# EAGLE design ManualOxy (EAGLE 6.5.0)
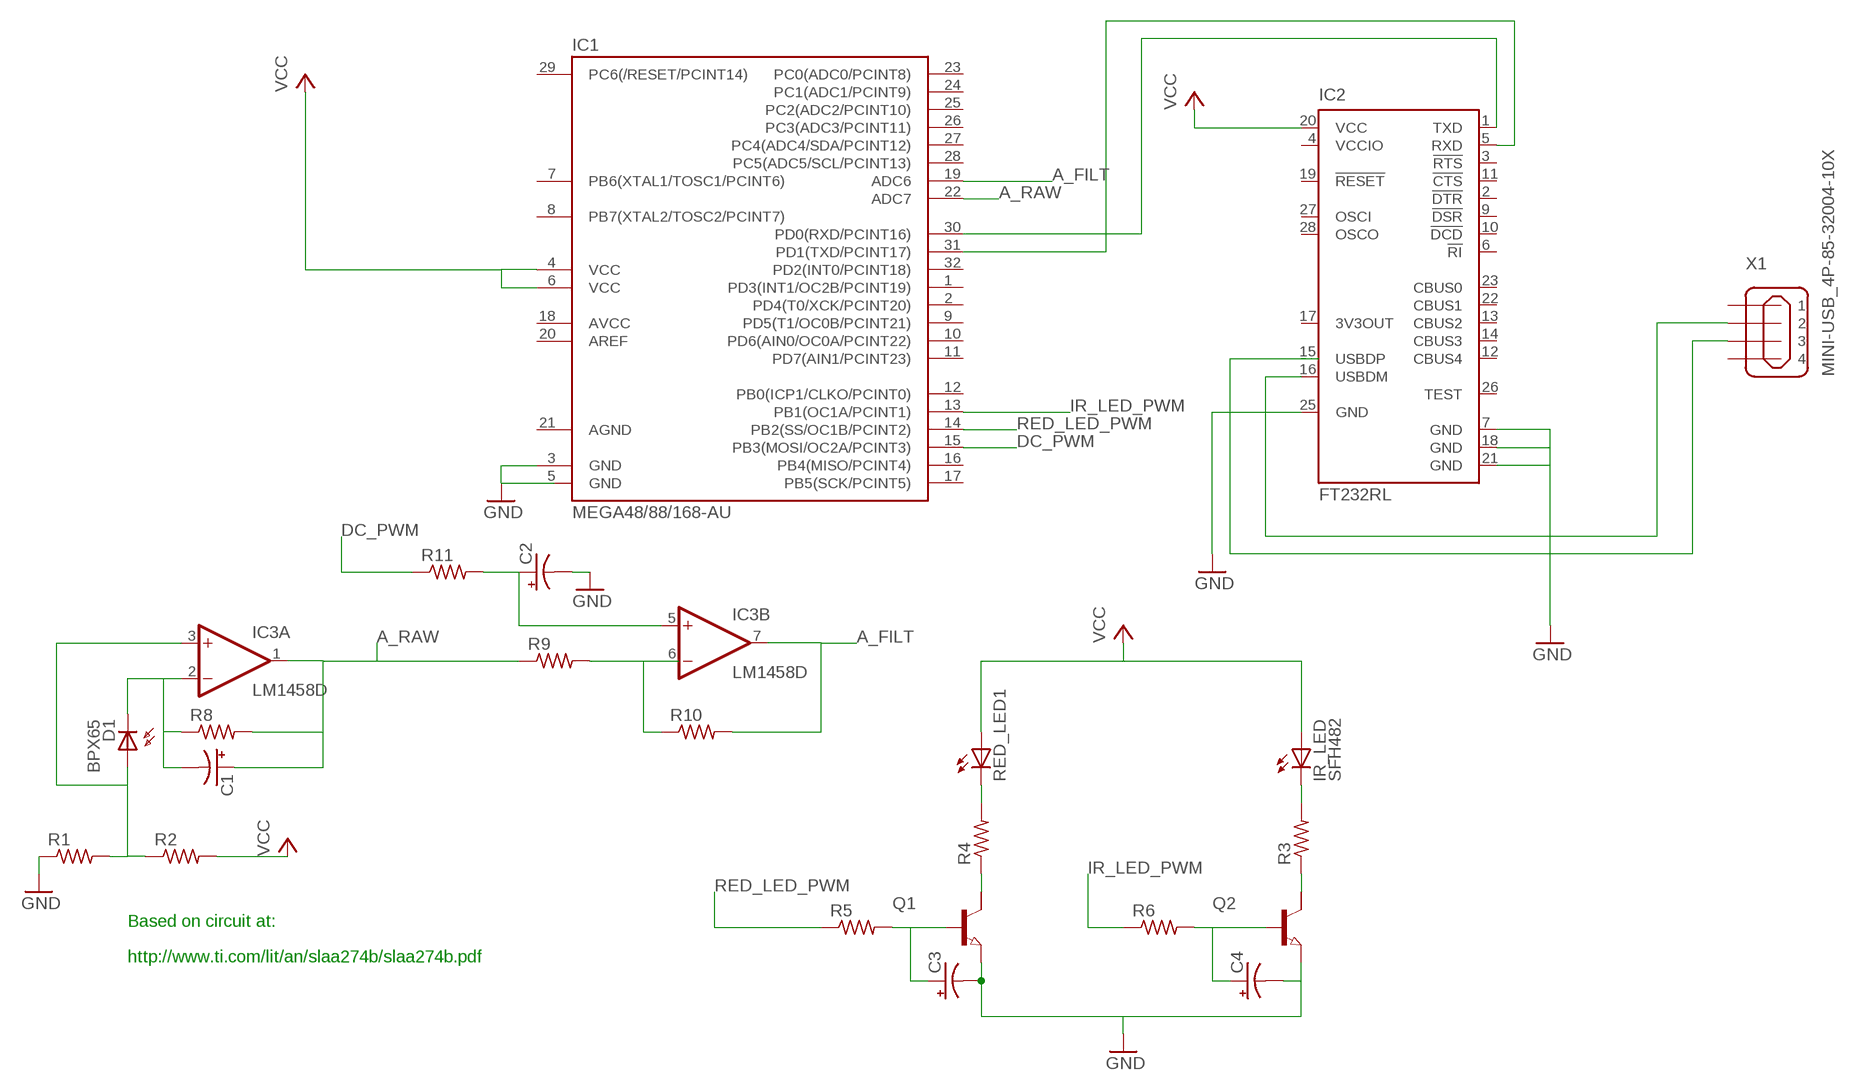
[diagram p0: schematic, sheet 1]

## Parts
C1  CPOL-US153CLV-0810  [153CLV-0810]
C2  CPOL-US153CLV-0810  [153CLV-0810]
C3  CPOL-US153CLV-0810  [153CLV-0810]
C4  CPOL-US153CLV-0810  [153CLV-0810]
D1  BPX65  [BPX65]
IC1  MEGA48/88/168-AU  [TQFP32-08]
IC2  FT232RL  [SSOP28]
IC3  LM1458D  [SO08]
IR_LED  SFH482  [SFH482]
Q1  NPN-TRANSISTIOR-2COLSOT143  [SOT143]
Q2  NPN-TRANSISTIOR-2COLSOT143  [SOT143]
R1  R-US_M2012  [M2012]
R2  R-US_M2012  [M2012]
R3  R-US_M2012  [M2012]
R4  R-US_M2012  [M2012]
R5  R-US_M2012  [M2012]
R6  R-US_M2012  [M2012]
R8  R-US_M2012  [M2012]
R9  R-US_M2012  [M2012]
R10  R-US_M2012  [M2012]
R11  R-US_M2012  [M2012]
RED_LED1  LED10MM  [LED10MM]
X1  MINI-USB_4P-85-32004-10X  [85-32004-10X]

## Nets
A_FILT: IC3.7(B:OUT) R10.2
A_RAW: C1.+ IC3.1(A:OUT) R8.2 R9.1
DC_PWM: IC1.15(PB3(MOSI/OC2A/PCINT3))
GND: C2.- C3.- C4.- IC1.3(GND) IC2.7(GND) IC2.18(GND) IC2.21(GND) IC2.25(GND) Q1.3(E) Q2.3(E) R1.1
IR_LED_PWM: IC1.13(PB1(OC1A/PCINT1))
N$1: IC1.30(PD0(RXD/PCINT16)) IC2.1(TXD)
N$2: IC1.31(PD1(TXD/PCINT17)) IC2.5(RXD)
N$3: IC2.16(USBDM) X1.2
N$4: X1.3
N$5: Q1.2(C) R4.1
N$6: R4.2 RED_LED1.K(C)
N$7: IR_LED.K(C) R3.2
N$8: Q2.2(C) R3.1
N$9: D1.A IC3.3(A:+IN) R1.2 R2.1
N$10: C1.- D1.K(C) IC3.2(A:-IN) R8.1
N$11: IC1.22(ADC7)
N$12: R9.2 R10.1
N$13: IC1.19(ADC6)
N$14: C2.+ IC3.5(B:+IN) R11.2
N$15: R11.1
N$16: C3.+ Q1.1(B) R5.2
N$17: R6.1
N$18: C4.+ Q2.1(B) R6.2
RED_LED_PWM: IC1.14(PB2(SS/OC1B/PCINT2))
VCC: IC1.4(VCC) IC1.6(VCC) IC2.20(VCC) IR_LED.A R2.2 RED_LED1.A
Unconnected: IC1.1(PD3(INT1/OC2B/PCINT19)) IC1.2(PD4(T0/XCK/PCINT20)) IC1.7(PB6(XTAL1/TOSC1/PCINT6)) IC1.8(PB7(XTAL2/TOSC2/PCINT7)) IC1.9(PD5(T1/OC0B/PCINT21)) IC1.10(PD6(AIN0/OC0A/PCINT22)) IC1.11(PD7(AIN1/PCINT23)) IC1.12(PB0(ICP1/CLKO/PCINT0)) IC1.16(PB4(MISO/PCINT4)) IC1.17(PB5(SCK/PCINT5)) IC1.18(AVCC) IC1.20(AREF) IC1.23(PC0(ADC0/PCINT8)) IC1.24(PC1(ADC1/PCINT9)) IC1.25(PC2(ADC2/PCINT10)) IC1.26(PC3(ADC3/PCINT11)) IC1.27(PC4(ADC4/SDA/PCINT12)) IC1.28(PC5(ADC5/SCL/PCINT13)) IC1.29(PC6(/RESET/PCINT14)) IC1.32(PD2(INT0/PCINT18)) IC2.2(!DTR) IC2.3(!RTS) IC2.6(!RI) IC2.9(!DSR) IC2.10(!DCD) IC2.11(!CTS) IC2.12(CBUS4) IC2.13(CBUS2) IC2.14(CBUS3) IC2.15(USBDP) IC2.17(3V3OUT) IC2.19(!RESET) IC2.22(CBUS1) IC2.23(CBUS0) IC2.26(TEST) IC2.27(OSCI) IC2.28(OSCO) IC3.6(B:-IN) Q1.4(C/) Q2.4(C/) R5.1 X1.1 X1.4

## Notes on the sheet
- Based on circuit at:
- http://www.ti.com/lit/an/slaa274b/slaa274b.pdf

## Power pins joined to a net without a drawn wire
AGND: IC1.21(AGND)
GND: IC1.5(GND)
V+: IC3.8(P:V+)
V-: IC3.4(P:V-)
VCCIO: IC2.4(VCCIO)

## Library data of the parts
C1-C4 = resistor:CPOL-US: POLARIZED CAPACITOR, American symbol
D1 = opto-trans-siemens:BPX65: PHOTO DIODE; MPN: BPX65.; OC_FARNELL: 327451; OC_NEWARK: 06WX2764
IC1 = avr-4:MEGA48/88/168
IC2 = ftdichip:FT232R: Source: http://www.ftdichip.com/Documents/DataSheets/DS_FT232R_v104.pdf; MPN: FT232RL; OC_FARNELL: 1146032; OC_NEWARK: 91K9918
IC3 = linear:*1458: OP AMP
IR_LED = led:SFH482: IR LED infrared emitting diode, Infineon
Q1 Q2 = semicon-smd-ipc:NPN-TRANSISTIOR-2COL: NPN TRANSISTOR 2 colletor pins
R1-R6 R8-R11 = rcl:R-US_: RESISTOR, American symbol
RED_LED1 = led:LED: LED OSRAM: - CHIPLED LG R971, LG N971, LY N971, LG Q971, LY Q971, LO R971, LY R971 LH N974, LH R974 LS Q976, LO Q976, LY Q976 LO Q996 - Hyper CHIPLED LW Q18S LB Q993, LB Q99A, LB R99A - SideLED LS A670, LO A670, LY A670, LG A670, LP A670 LB A673, LV A673, LT A673, LW A673 LH A674 LY A675 LS A676, LA A676, LO A676, LY A676, LW A676 LS A679, LY A679, LG A679 - Hyper Micro SIDELED® LS Y876, LA Y876, LO Y876, LY Y876 LT Y87S - SmartLED LW L88C, LW L88S LB L89C, LB L89S, LG L890 LS L89K, LO L89K, LY L89K LS L896, LA L896, LO L896, LY L896 - TOPLED LS T670, LO T670, LY T670, LG T670, LP T670 LSG T670, LSP T670, LSY T670, LOP T670, LYG T670 LG T671, LOG T671, LSG T671 LB T673, LV T673, LT T673, LW T673 LH T674 LS T676, LA T676, LO T676, LY T676, LB T676, LH T676, LSB T676, LW T676 LB T67C, LV T67C, LT T67C, LS T67K, LO T67K, LY T67K, LW E67C LS E67B, LA E67B, LO E67B, LY E67B, LB E67C, LV E67C, LT E67C LW T67C LS T679, LY T679, LG T679 LS T770, LO T770, LY T770, LG T770, LP T770 LB T773, LV T773, LT T773, LW T773 LH T774 LS E675, LA E675, LY E675, LS T675 LS T776, LA T776, LO T776, LY T776, LB T776 LHGB T686 LT T68C, LB T68C - Hyper Mini TOPLED® LB M676 - Mini TOPLED Santana® LG M470 LS M47K, LO M47K, LY M47K Source: http://www.osram.convergy.de LUXEON: - LUMILED® LXK2-PW12-R00, LXK2-PW12-S00, LXK2-PW14-U00, LXK2-PW14-V00 LXK2-PM12-R00, LXK2-PM12-S00, LXK2-PM14-U00 LXK2-PE12-Q00, LXK2-PE12-R00, LXK2-PE12-S00, LXK2-PE14-T00, LXK2-PE14-U00 LXK2-PB12-K00, LXK2-PB12-L00, LXK2-PB12-M00, LXK2-PB14-N00, LXK2-PB14-P00, LXK2-PB14-Q00 LXK2-PR12-L00, LXK2-PR12-M00, LXK2-PR14-Q00, LXK2-PR14-R00 LXK2-PD12-Q00, LXK2-PD12-R00, LXK2-PD12-S00 LXK2-PH12-R00, LXK2-PH12-S00 LXK2-PL12-P00, LXK2-PL12-Q00, LXK2-PL12-R00 Source: www.luxeon.com KINGBRIGHT: KA-3528ASYC Source: www.kingbright.com
X1 = con-cypressindustries:MINI-USB_4P-: MINI USB 4 Pol. Source: www.cypressindustries.com; OC_FARNELL: unknown; OC_NEWARK: unknown

## Board
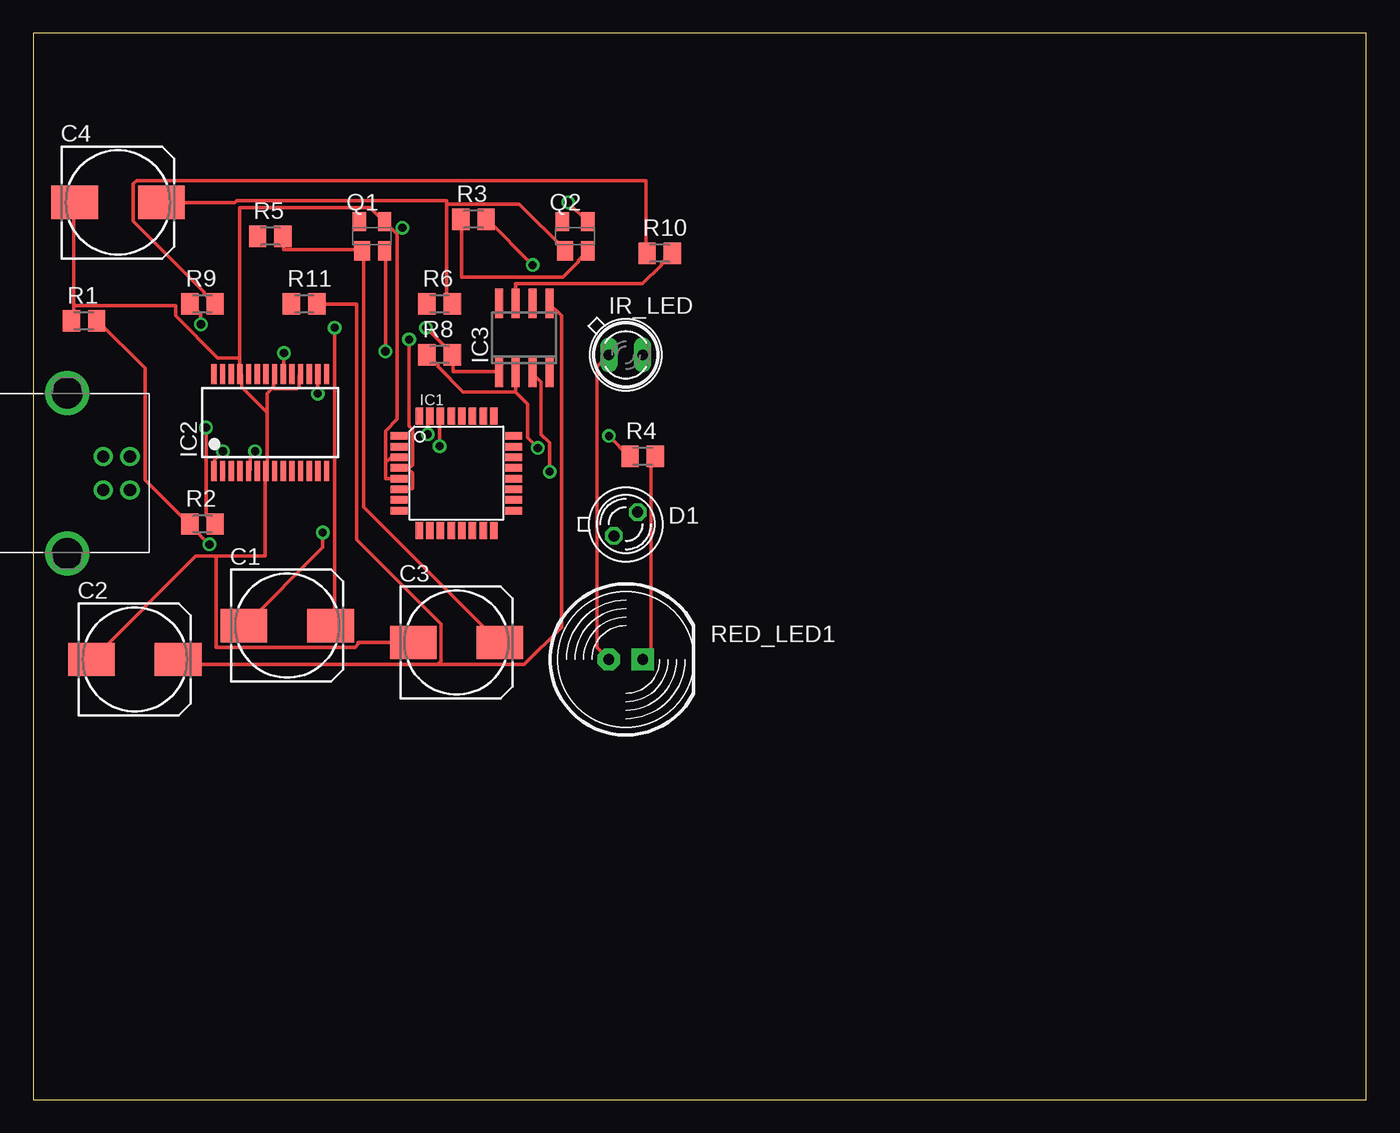
[diagram p1: board, top side]
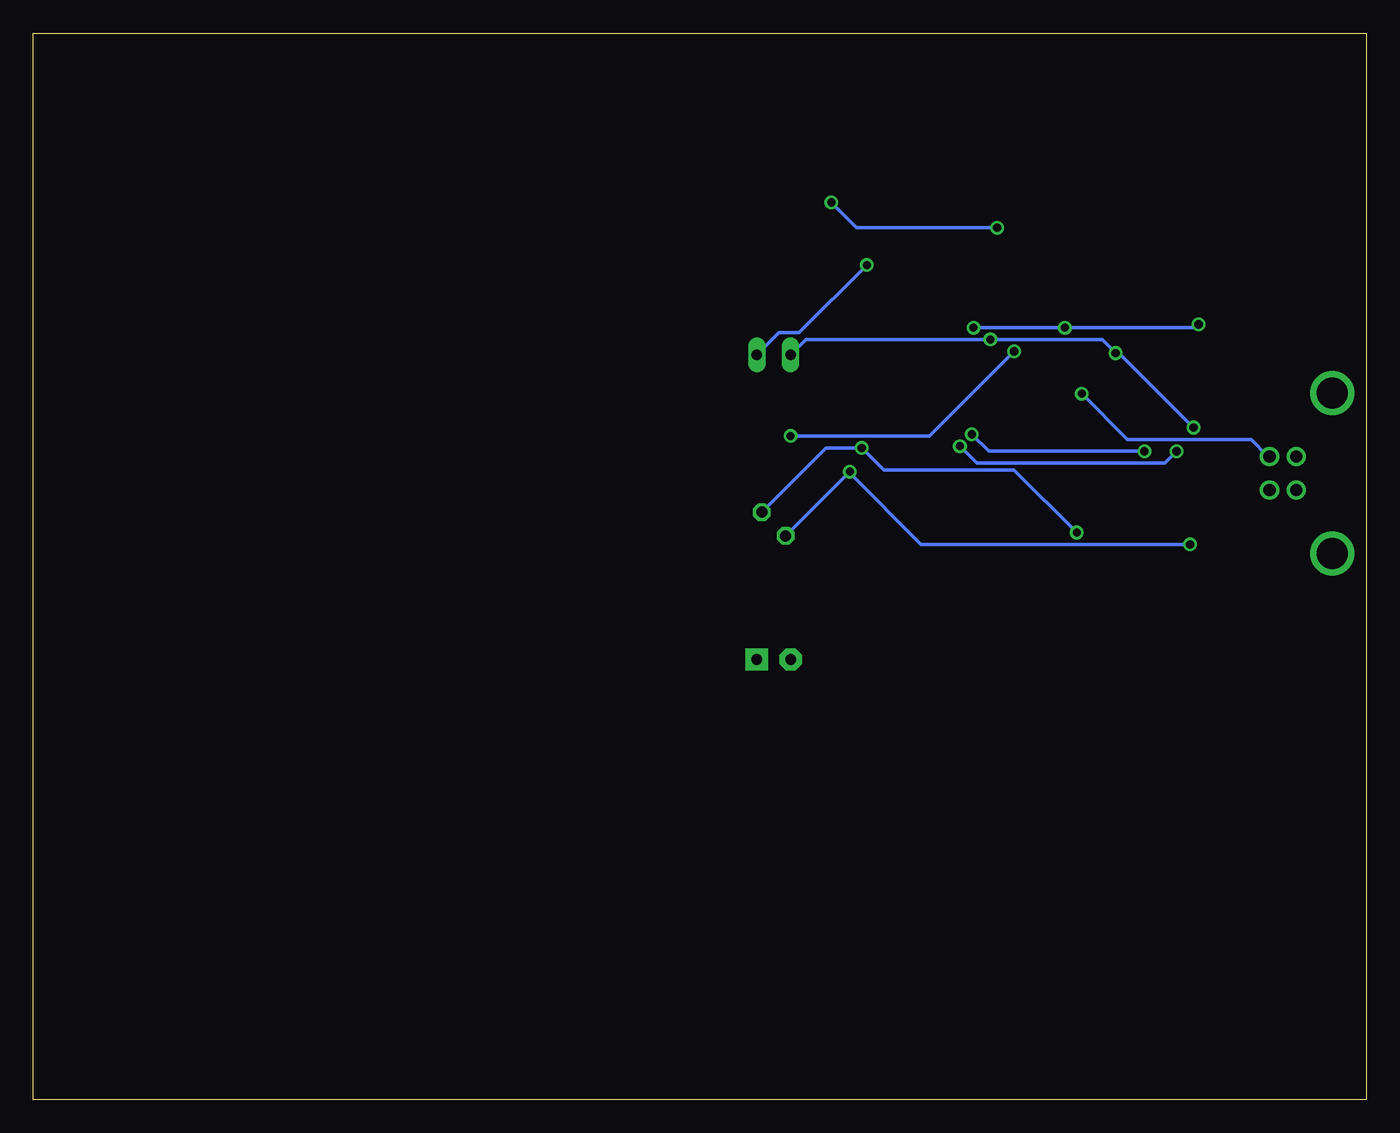
[diagram p2: board, bottom side, seen from below]

Size 100 x 80 mm. Coordinates in mm from the lower left corner, seen from the top.
Outline: 0,0 100,0 100,80 0,80 0,0
Copper layers (1*16): Top 0.035mm / dielectric 1.5mm / Bottom 0.035mm
Design rules "default": minimum track width 10mil, minimum drill 24mil, track to track 8mil, track to pad 8mil, pad to pad 8mil, via to via 8mil, smd to smd 8mil, copper to edge 40mil, drill to drill 8mil, minimum pad ring 10mil, minimum via ring 8mil, stop-mask expansion 4mil, vias tented up to drill 0mil, thermal gap 10mil

### Footprints (pad centres in the part's own frame; a part is rotated, then mirrored left to right if it is on the bottom)
153CLV-0810 = smd 3.5 x 2.5: + 3.25,0; - -3.25,0
BPX65 = drill 0.813 octagon: A -0.889,-0.889; K 0.889,0.889
TQFP32-08 = smd 1.27 x 0.559: 1 -4.293,2.8; 2 -4.293,2; 3 -4.293,1.2; 4 -4.293,0.4; 5 -4.293,-0.4; 6 -4.293,-1.2; 7 -4.293,-2; 8 -4.293,-2.8; 17 4.293,-2.8; 18 4.293,-2; 19 4.293,-1.2; 20 4.293,-0.4; 21 4.293,0.4; 22 4.293,1.2; 23 4.293,2; 24 4.293,2.8 | smd 0.559 x 1.27: 9 -2.8,-4.293; 10 -2,-4.293; 11 -1.2,-4.293; 12 -0.4,-4.293; 13 0.4,-4.293; 14 1.2,-4.293; 15 2,-4.293; 16 2.8,-4.293; 25 2.8,4.293; 26 2,4.293; 27 1.2,4.293; 28 0.4,4.293; 29 -0.4,4.293; 30 -1.2,4.293; 31 -2,4.293; 32 -2.8,4.293
SSOP28 = smd 0.4 x 1.5: 1 -4.225,-3.625; 2 -3.575,-3.625; 3 -2.925,-3.625; 4 -2.275,-3.625; 5 -1.625,-3.625; 6 -0.975,-3.625; 7 -0.325,-3.625; 8 0.325,-3.625; 9 0.975,-3.625; 10 1.625,-3.625; 11 2.275,-3.625; 12 2.925,-3.625; 13 3.575,-3.625; 14 4.225,-3.625; 15 4.225,3.625; 16 3.575,3.625; 17 2.925,3.625; 18 2.275,3.625; 19 1.625,3.625; 20 0.975,3.625; 21 0.325,3.625; 22 -0.325,3.625; 23 -0.975,3.625; 24 -1.625,3.625; 25 -2.275,3.625; 26 -2.925,3.625; 27 -3.575,3.625; 28 -4.225,3.625
SO08 = smd 0.6 x 2.2: 1 -1.905,-2.6; 2 -0.635,-2.6; 3 0.635,-2.6; 4 1.905,-2.6; 5 1.905,2.6; 6 0.635,2.6; 7 -0.635,2.6; 8 -1.905,2.6
SFH482 = drill 0.813 long: A -1.27,0; K 1.27,0
SOT143 = smd 1.2 x 1.44: 1 -0.75,-1.1 | smd 1 x 1.44: 2 0.95,-1.1; 3 0.95,1.1; 4 -0.95,1.1
M2012 = smd 1.3 x 1.6: 1 -0.95,0; 2 0.95,0
LED10MM = drill 0.813 pad 1.676 octagon: A -1.27,0 | drill 0.813 pad 1.676 square: K 1.27,0
85-32004-10X = drill 0.92 pad 1.27: 1 4.71,-1.25; 2 4.71,1.25; 3 2.71,1.25; 4 2.71,-1.25 | drill 2.3 pad 3: M1 0,6.02; M2 0,-6.02

### Placement (x,y rotation side)
C1  19.05,35.56 0 top
C2  7.62,33.02 0 top
C3  31.75,34.29 0 top
C4  6.35,67.31 0 top
D1  44.45,43.18 0 top
IC1  31.75,46.99 0 top
IC2  17.78,50.8 0 top
IC3  36.83,57.15 0 top
IR_LED  44.45,55.88 0 top
Q1  25.4,64.77 0 top
Q2  40.64,64.77 0 top
R1  3.81,58.42 0 top
R2  12.7,43.18 0 top
R3  33.02,66.04 0 top
R4  45.72,48.26 0 top
R5  17.78,64.77 0 top
R6  30.48,59.69 0 top
R8  30.48,55.88 0 top
R9  12.7,59.69 0 top
R10  46.99,63.5 0 top
R11  20.32,59.69 0 top
RED_LED1  44.45,33.02 0 top
X1  2.54,46.99 0 top

### Tracks (layer width: path | path; a pad name or v marks a point on that pad's centre or on a via)
A_FILT
  Top 0.254: IC3.7 36.2,61.21 45.72,61.21 47.12,62.61 47.12,62.74 47.88,63.5 R10.2
A_RAW  (via drill 0.61)
  Top 0.254: v12.57,58.17 12.57,58.93 11.81,59.69 R9.1 | v29.46,57.91 31.37,56.01 31.37,55.88 R8.2 31.5,55.88 31.5,54.61 34.92,54.61 IC3.1 | v22.61,57.91 22.61,35.81 22.35,35.56 C1.+
  Bottom 0.254: v12.57,58.17 12.83,57.91 v22.61,57.91 v29.46,57.91
GND  (via drill 0.61)
  Top 0.254: 26.48,47.82 26.8,48.13 27.43,48.13 IC1.3 | 26.48,47.82 26.42,47.75 26.42,46.61 27.43,46.61 IC1.5 | 27.24,64.96 27.3,64.9 27.3,51.05 26.42,50.16 26.42,47.88 26.48,47.82 | 27.24,64.96 26.42,65.79 Q1.3 26.29,65.91 25.27,66.93 15.49,66.93 15.49,55.63 | v40.13,67.31 41.53,65.91 Q2.3 | 27.24,64.96 v27.69,65.41 | 3.05,59.56 3.05,67.31 C4.- | 3.05,59.56 3.05,58.55 2.92,58.42 R1.1 | 17.53,51.56 17.53,52.96 17.97,53.4 | 17.53,51.56 17.53,47.24 IC2.7 17.4,47.12 17.4,40.77 13.72,40.77 | 17.97,53.4 18.03,53.47 18.03,54.36 IC2.21 | 17.53,51.56 15.62,53.47 15.62,54.36 IC2.25 15.49,54.48 15.49,55.63 | IC2.18 19.94,54.36 19.94,53.47 19.81,53.34 18.03,53.34 17.97,53.4 | 13.72,40.77 12.19,40.77 4.45,33.02 C2.- | C3.- 24.38,34.29 24.38,34.16 24.13,33.91 13.72,33.91 13.72,40.77 | 3.05,59.56 10.67,59.56 10.67,58.8 13.84,55.63 15.49,55.63
  Bottom 0.254: v40.13,67.31 38.23,65.41 v27.69,65.41
N$1  (via drill 0.61)
  Top 0.254: v30.48,49.02 30.48,51.18 IC1.30 | v14.22,48.64 13.59,48.01 13.59,47.24 IC2.1
  Bottom 0.254: v30.48,49.02 29.21,47.75 15.11,47.75 v14.22,48.64
N$2  (via drill 0.61)
  Top 0.254: v29.59,49.91 29.59,51.05 29.72,51.18 IC1.31 | v16.64,48.64 16.26,48.26 16.26,47.24 IC2.5
  Bottom 0.254: v29.59,49.91 28.32,48.64 v16.64,48.64
N$3  (via drill 0.61)
  Top 0.254: v21.34,52.96 21.34,54.36 IC2.16
  Bottom 0.254: v21.34,52.96 17.91,49.53 8.64,49.53 7.37,48.26 X1.2
N$5  (via drill 0.61)
  Top 0.254: v26.42,56.13 26.42,63.63 Q1.2 | v43.18,49.78 44.7,48.26 R4.1
  Bottom 0.254: v26.42,56.13 32.77,49.78 v43.18,49.78
N$6
  Top 0.254: RED_LED1.K 46.35,33.66 46.35,48.01 46.61,48.26 R4.2
N$7  (via drill 0.61)
  Top 0.254: v37.47,62.61 34.04,66.04 R3.2
  Bottom 0.254: v37.47,62.61 42.55,57.53 44.07,57.53 IR_LED.K
N$8
  Top 0.254: Q2.2 41.53,63.63 40.89,62.99 40.89,62.87 39.75,61.72 32.13,61.72 32.13,66.04 R3.1
N$9  (via drill 0.61)
  Top 0.254: v38.73,47.12 38.73,49.28 38.1,49.91 38.1,53.85 37.47,54.48 IC3.3 | R1.2 4.83,58.42 8.38,54.86 8.38,46.48 11.68,43.18 R2.1 11.81,43.18 11.81,43.05 v13.21,41.66
  Bottom 0.254: D1.A v38.73,47.12 38.73,46.99 33.4,41.66 v13.21,41.66
N$10  (via drill 0.61)
  Top 0.254: 36.2,53.09 32.26,53.09 30.35,54.99 30.35,55.12 29.59,55.88 R8.1 | IC3.2 36.2,53.09 | v37.85,48.9 37.08,49.66 37.08,52.2 36.2,53.09 | v21.72,42.55 21.72,41.4 15.88,35.56 C1.-
  Bottom 0.254: D1.K 40.51,48.9 v37.85,48.9 36.2,47.24 26.42,47.24 v21.72,42.55
N$12
  Top 0.254: R9.2 13.59,59.69 12.83,60.45 12.83,60.58 7.49,65.91 7.49,68.71 7.75,68.96 45.97,68.96 45.97,63.5 R10.1
N$14
  Top 0.254: R11.2 24.26,59.69 24.26,42.04 30.61,35.69 30.61,32.89 30.42,32.7 | 30.42,32.7 30.35,32.64 10.92,32.64 10.92,33.02 C2.+ | IC3.5 38.73,59.69 39.62,58.8 39.62,35.43 36.83,32.64 30.48,32.64 30.42,32.7
N$16
  Top 0.254: R5.2 18.8,64.77 18.8,63.75 24.64,63.75 Q1.1 24.77,63.63 24.77,44.45 34.92,34.29 C3.+
N$18
  Top 0.254: 30.99,67.18 36.45,67.18 39.88,63.75 Q2.1 | 30.99,67.18 30.99,60.07 31.37,59.69 R6.2 | C4.+ 15.11,67.31 15.24,67.44 30.99,67.44 30.99,67.18
VCC  (via drill 0.61)
  Top 0.254: 28.13,47.31 28.07,47.37 27.56,47.37 IC1.4 | 28.13,47.31 28.45,46.99 28.45,45.85 27.56,45.85 IC1.6 | v18.8,56.01 18.8,54.48 IC2.20 | v12.95,50.42 12.95,43.81 13.59,43.18 R2.2 | 28.13,47.31 28.45,47.62 28.45,50.29 28.19,50.55 v28.19,57.02 | RED_LED1.A 42.29,33.91 42.29,54.99 IR_LED.A
  Bottom 0.254: IR_LED.A 42.04,57.02 v28.19,57.02 19.81,57.02 v18.8,56.01 18.54,56.01 v12.95,50.42